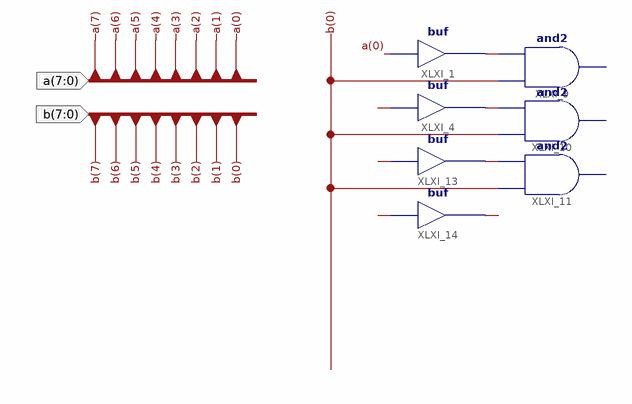
[diagram p0: schematic sheet 1]
// Xilinx ISE schematic four_bit_multiplier.sch (spartan6) as structural Verilog: 7 symbols, 2 ports
module four_bit_multiplier (
  input  [7:0] a,
  input  [7:0] b
);

  wire XLXN_25, XLXN_30, XLXN_31, XLXN_32, XLXN_34, XLXN_35, XLXN_36;

  buf XLXI_1 (XLXN_25, a[0]);
  // and2 XLXI_9 has open pins: I0=b[0], I1=XLXN_25, O=open
  // and2 XLXI_10 has open pins: I0=b[0], I1=XLXN_30, O=open
  // and2 XLXI_11 has open pins: I0=b[0], I1=XLXN_31, O=open
  buf XLXI_4 (XLXN_30, XLXN_34);
  buf XLXI_13 (XLXN_31, XLXN_35);
  buf XLXI_14 (XLXN_32, XLXN_36);
endmodule
